# EAGLE schematic 0123-chips-test-pcb-01 (EAGLE 9.6.2)
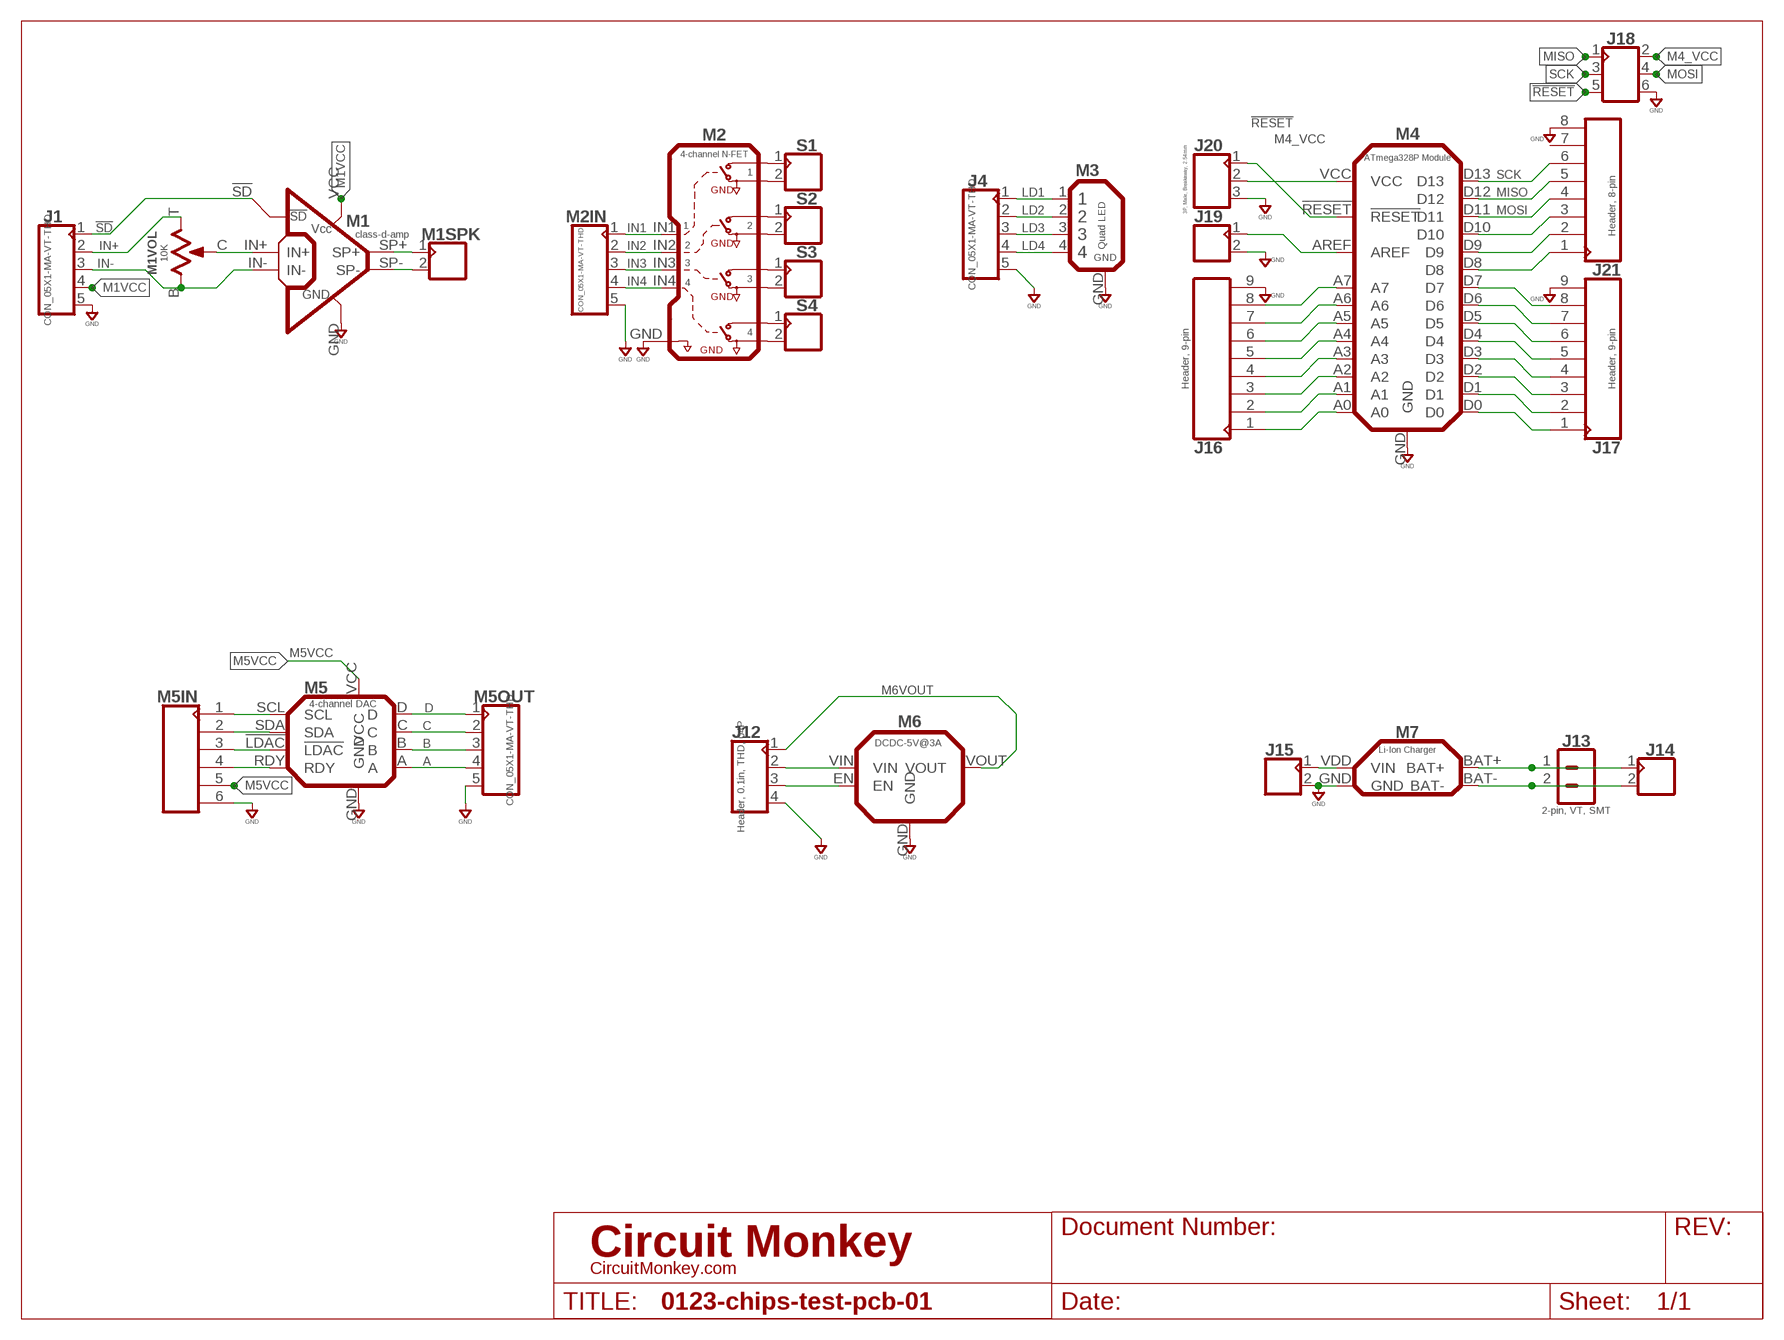
[diagram p0: schematic, sheet 1]

## Parts
J1  CON_05X1-MA-VT-THD  [MA05X1-VT-THD]
J4  CON_05X1-MA-VT-THD  [MA05X1-VT-THD]
J12  Header, 0.1in, THD, 04P  CON_04X1-THD-VT  [MA04X1-VT-THD]
J13  2-pin, VT, SMT  02PVT-SMT  [B2B-PH-SM4]
J14  CON_02X1-2.54MM-THD-VT  [MA02X1-VT-THD]
J15  CON_02X1-2.54MM-THD-VT  [MA02X1-VT-THD]
J16  Header, 9-pin  CON_09X1-VT-THD  [MA09X1-VT-THD]
J17  Header, 9-pin  CON_09X1-VT-THD  [MA09X1-VT-THD]
J18  CON_03X2-VT  [MA03X2-VT-THD]
J19  CON_02X1-2.54MM-THD-VT  [MA02X1-VT-THD]
J20  3P, Male, Breakaway, 2.54mm  CON_03X1-2.54MM-THD-VT  [MA03X1-VT-THD]
J21  Header, 8-pin  CON_08X1-VT-THD  [MA08X1-VT-THD]
M1  class-d-amp  0116REV-A  [0116A]
M1SPK  CON_02X1-2.54MM-THD-VT  [MA02X1-VT-THD]
M1VOL  10K  TRIMPOTTC33X  [TRIM_BOURNS_TC33X]
M2  4-channel N-FET  0117REV-A  [0117A]
M2IN  CON_05X1-MA-VT-THD  [MA05X1-VT-THD]
M3  Quad LED  0118REV-A  [0118A]
M4  ATmega328P Module  0119REV-A  [0119A]
M5  4-channel DAC  0120REV-A  [0120A]
M5IN  CON_06X1-VT  [MA06X1-VT-THD]
M5OUT  CON_05X1-MA-VT-THD  [MA05X1-VT-THD]
M6  DCDC-5V@3A  0121REV-A  [0121A]
M7  Li-Ion Charger  0122REV-A  [0122A]
S1  CON_02X1-2.54MM-THD-VT  [MA02X1-VT-THD]
S2  CON_02X1-2.54MM-THD-VT  [MA02X1-VT-THD]
S3  CON_02X1-2.54MM-THD-VT  [MA02X1-VT-THD]
S4  CON_02X1-2.54MM-THD-VT  [MA02X1-VT-THD]

## Nets
!RESET: J18.5 J20.1 M4.!RESET
!SD: J1.1 M1.!SD
A: M5.A M5OUT.4
B: M5.B M5OUT.3
C: M5.C M5OUT.2
D: M5.D M5OUT.1
GND: J1.5 J4.5 J12.4 J15.2 J16.9 J17.9 J18.6 J19.2 J20.3 J21.8 M1.GND M2.GND M2IN.5 M3.GND M4.GND M5.GND M5IN.6 M5OUT.5 M6.GND M7.GND
IN1: M2.IN1 M2IN.1
IN2: M2.IN2 M2IN.2
IN3: M2.IN3 M2IN.3
IN4: M2.IN4 M2IN.4
IN+: J1.2 M1VOL.T
IN-: J1.3 M1.IN- M1VOL.B
LD1: J4.1 M3.1
LD2: J4.2 M3.2
LD3: J4.3 M3.3
LD4: J4.4 M3.4
M1VCC: J1.4 M1.VCC
M4_VCC: J18.2 J20.2 M4.VCC
M5VCC: M5.VCC M5IN.5
M6VOUT: J12.1 M6.VOUT
MISO: J18.1 J21.5 M4.D12
MOSI: J18.4 J21.4 M4.D11
N$1: M1.SP- M1SPK.2
N$2: M1.SP+ M1SPK.1
N$3: M5.RDY M5IN.4
N$4: M5.!LDAC M5IN.3
N$5: M5.SDA M5IN.2
N$6: M5.SCL M5IN.1
N$10: M2.GND1 S1.2
N$11: M2.OUT1(V1) S1.1
N$12: M2.GND2 S2.2
N$13: M2.OUT2(V2) S2.1
N$14: M2.GND3 S3.2
N$15: M2.OUT3(V3) S3.1
N$16: M2.GND4 S4.2
N$17: M2.OUT4(V4) S4.1
N$32: J12.2 M6.VIN
N$33: J12.3 M6.EN
N$34: J13.1 J14.1 M7.BAT+
N$35: J13.2 J14.2 M7.BAT-
N$36: J17.1 M4.D0
N$37: J15.1 M7.VDD(VIN)
N$38: J17.2 M4.D1
N$39: J17.3 M4.D2
N$40: J17.4 M4.D3
N$41: J17.5 M4.D4
N$42: J17.6 M4.D5
N$43: J17.7 M4.D6
N$44: J17.8 M4.D7
N$45: J16.1 M4.A0
N$46: J16.2 M4.A1
N$47: J16.3 M4.A2
N$48: J16.4 M4.A3
N$49: J16.5 M4.A4
N$50: J16.6 M4.A5
N$51: J16.7 M4.A6
N$52: J16.8 M4.A7
N$53: J19.1 M4.AREF
N$54: M1.IN+ M1VOL.C
N$55: J21.1 M4.D8
N$56: J21.2 M4.D9
N$57: J21.3 M4.D10
SCK: J18.3 J21.6 M4.D13
Unconnected: J21.7

## Library data of the parts
J1 J4 M2IN M5OUT = con-headers:CON_05X1: Connector, 5P
J12 = con-headers:CON_04X1: Headers, 04 pin; MFR: Molex; MPN: 022284043
J13 = con-jst:02P: 2 pin connector; MFR: JST; MPN: B2B-PH-SM4
J14 J15 J19 M1SPK S1-S4 = con-headers:CON_02X1: Connector, 2P
J16 J17 = con-headers:CON_09X1: Connector, 9-pin, 1-row; COST01: 0.15
J18 = con-headers:CON_03X2: Header, 3x2 (6-pin)
J20 = con-headers:CON_03X1: Header, 3-pin, single row
J21 = con-headers:CON_08X1: Header, 8-pin, 1-row, 2.54mm; COST01: 0.14
M1 = circuit-monkey-chips:0116: Circuit Monkey CHIPs #0116 - Class-D Audio Amplifier; MFR: Circuit Monkey; MPN: 0116A
M1VOL = rlc:TRIMPOT: Potentiometer; MFR: Bourns; MPN: TC33X; VALUE: XX OHMS
M2 = circuit-monkey-chips:0117: Circuit Monkey #0117 - Quad N-FET Module; MFR: Circuit Monkey; MPN: 0117A
M3 = circuit-monkey-chips:0118: Circuit Monkey #0118 - Quad LED Module; MFR: Circuit Monkey; MPN: 0118A
M4 = circuit-monkey-chips:0119: Circuit Monkey #0119 - ATmega328P Module; MFR: Circuit Monkey; MPN: 0119A
M5 = circuit-monkey-chips:0120: Circuit Monkey #0120 - Quad I2C DAC; MFR: Circuit Monkey; MPN: 0120A
M5IN = con-headers:CON_06X1: Header, 6-pin, single row
M6 = circuit-monkey-chips:0121: Circuit Monkey #0121 - DCDC Converter 5V@3A; MFR: Circuit Monkey; MPN: 0121A
M7 = circuit-monkey-chips:0122: Circuit Monkey #0122 - Li-Ion Charger; MFR: Circuit Monkey; MPN: 0122A